# Altium schematic sheet RS-232.SchDoc
size A4
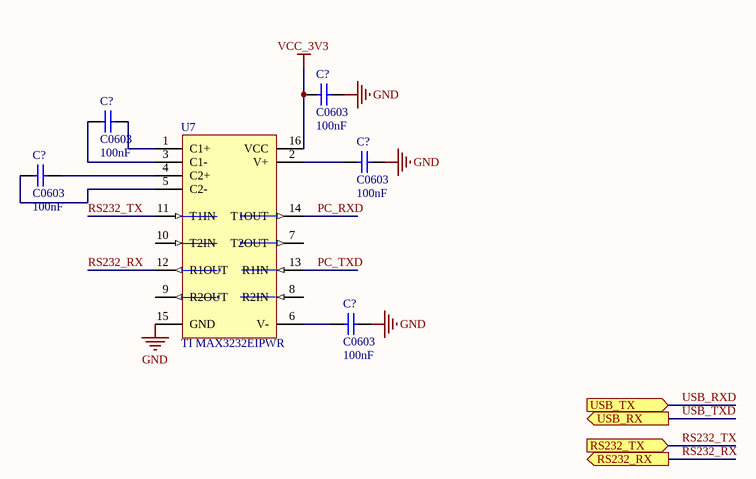
[diagram p0: RS-232.SchDoc]

## Parts
(Parts that share a designator on the sheet are numbered #1, #2 ... from top to bottom, then left to right.)
C?#1  C0603  value 100nF  [0603]
C?#2  C0603  value 100nF  [0603]
C?#3  C0603  value 100nF  [0603]
C?#4  C0603  value 100nF  [0603]
C?#5  C0603  value 100nF  [0603]
U7  TI MAX3232EIPWR  [TSSOP16]

## Ports
RS232_RX (out), RS232_TX (in), USB_RX (out), USB_TX (in)

## Nets
GND: C?#1.1 C?#3.1 C?#5.1 U7.15(GND)
VCC_3V3: C?#1.2 U7.16(VCC)
PC_RXD: U7.14(T1OUT)
PC_TXD: U7.13(R1IN)
RS232_RX: U7.12(R1OUT) ; port RS232_RX
RS232_TX: U7.11(T1IN) ; port RS232_TX
USB_RXD: port USB_TX
USB_TXD: port USB_RX
NetC?#2_1: C?#2.1 U7.1(C1+)
NetC?#2_2: C?#2.2 U7.3(C1-)
NetC?#3_2: C?#3.2 U7.2(V+)
NetC?#4_1: C?#4.1 U7.4(C2+)
NetC?#4_2: C?#4.2 U7.5(C2-)
NetC?#5_2: C?#5.2 U7.6(V-)

Not connected (* = marked no-connect by the designer): U7 7(T2OUT) 8(R2IN) 9(R2OUT) 10(T2IN)

## Library data of the parts
C?#1-C?#5 = C0603: Ceramic Chip Capacitor - Standard; Note: Footprint corresponds to dimensions for bulk cassette packaging. This case size has tightened tolerances.; Published: 17-Jul-2002; LatestRevisionDate: 19-Mar-2004; LatestRevisionNote: Silkscreen size reduced.; DatasheetDocument: Mar-2001; PackageDocument: Mar-2001; PackageReference: 0603; Publisher: Altium Limited; Code_JEITA: 0603; Code_IPC: 1608 [0603]; ComponentLink1Description: Manufacturer Link; ComponentLink1URL: http://www.kemet.com/; ComponentLink2Description: Datasheet; ComponentLink2URL: http://www.kemet.com/kemet/web/homepage/kechome.nsf/vapubfilesname/F3102TA.pdf/$file/F3102TA.pdf
U7 = MAX3232ESE: 3.0V TO 5.5V, Low-Power, up to 1Mbps, True RS-232 Transceiver Using Four 0.1µF External Capacitor; Manufacturer: Maxim; Class I: Communication; Published: 16-Jan-2001; Revision: July-2002: Re-released for DXP Platform.; Datasheet: Latest Revision: Mar-1999; Package Reference: NSO16; Publisher: Altium Limited; Class II: Transceiver